# EasyEDA Pro project Kaleidoscope.eprj

# Schematic ESP32 Kaleidoscope V2
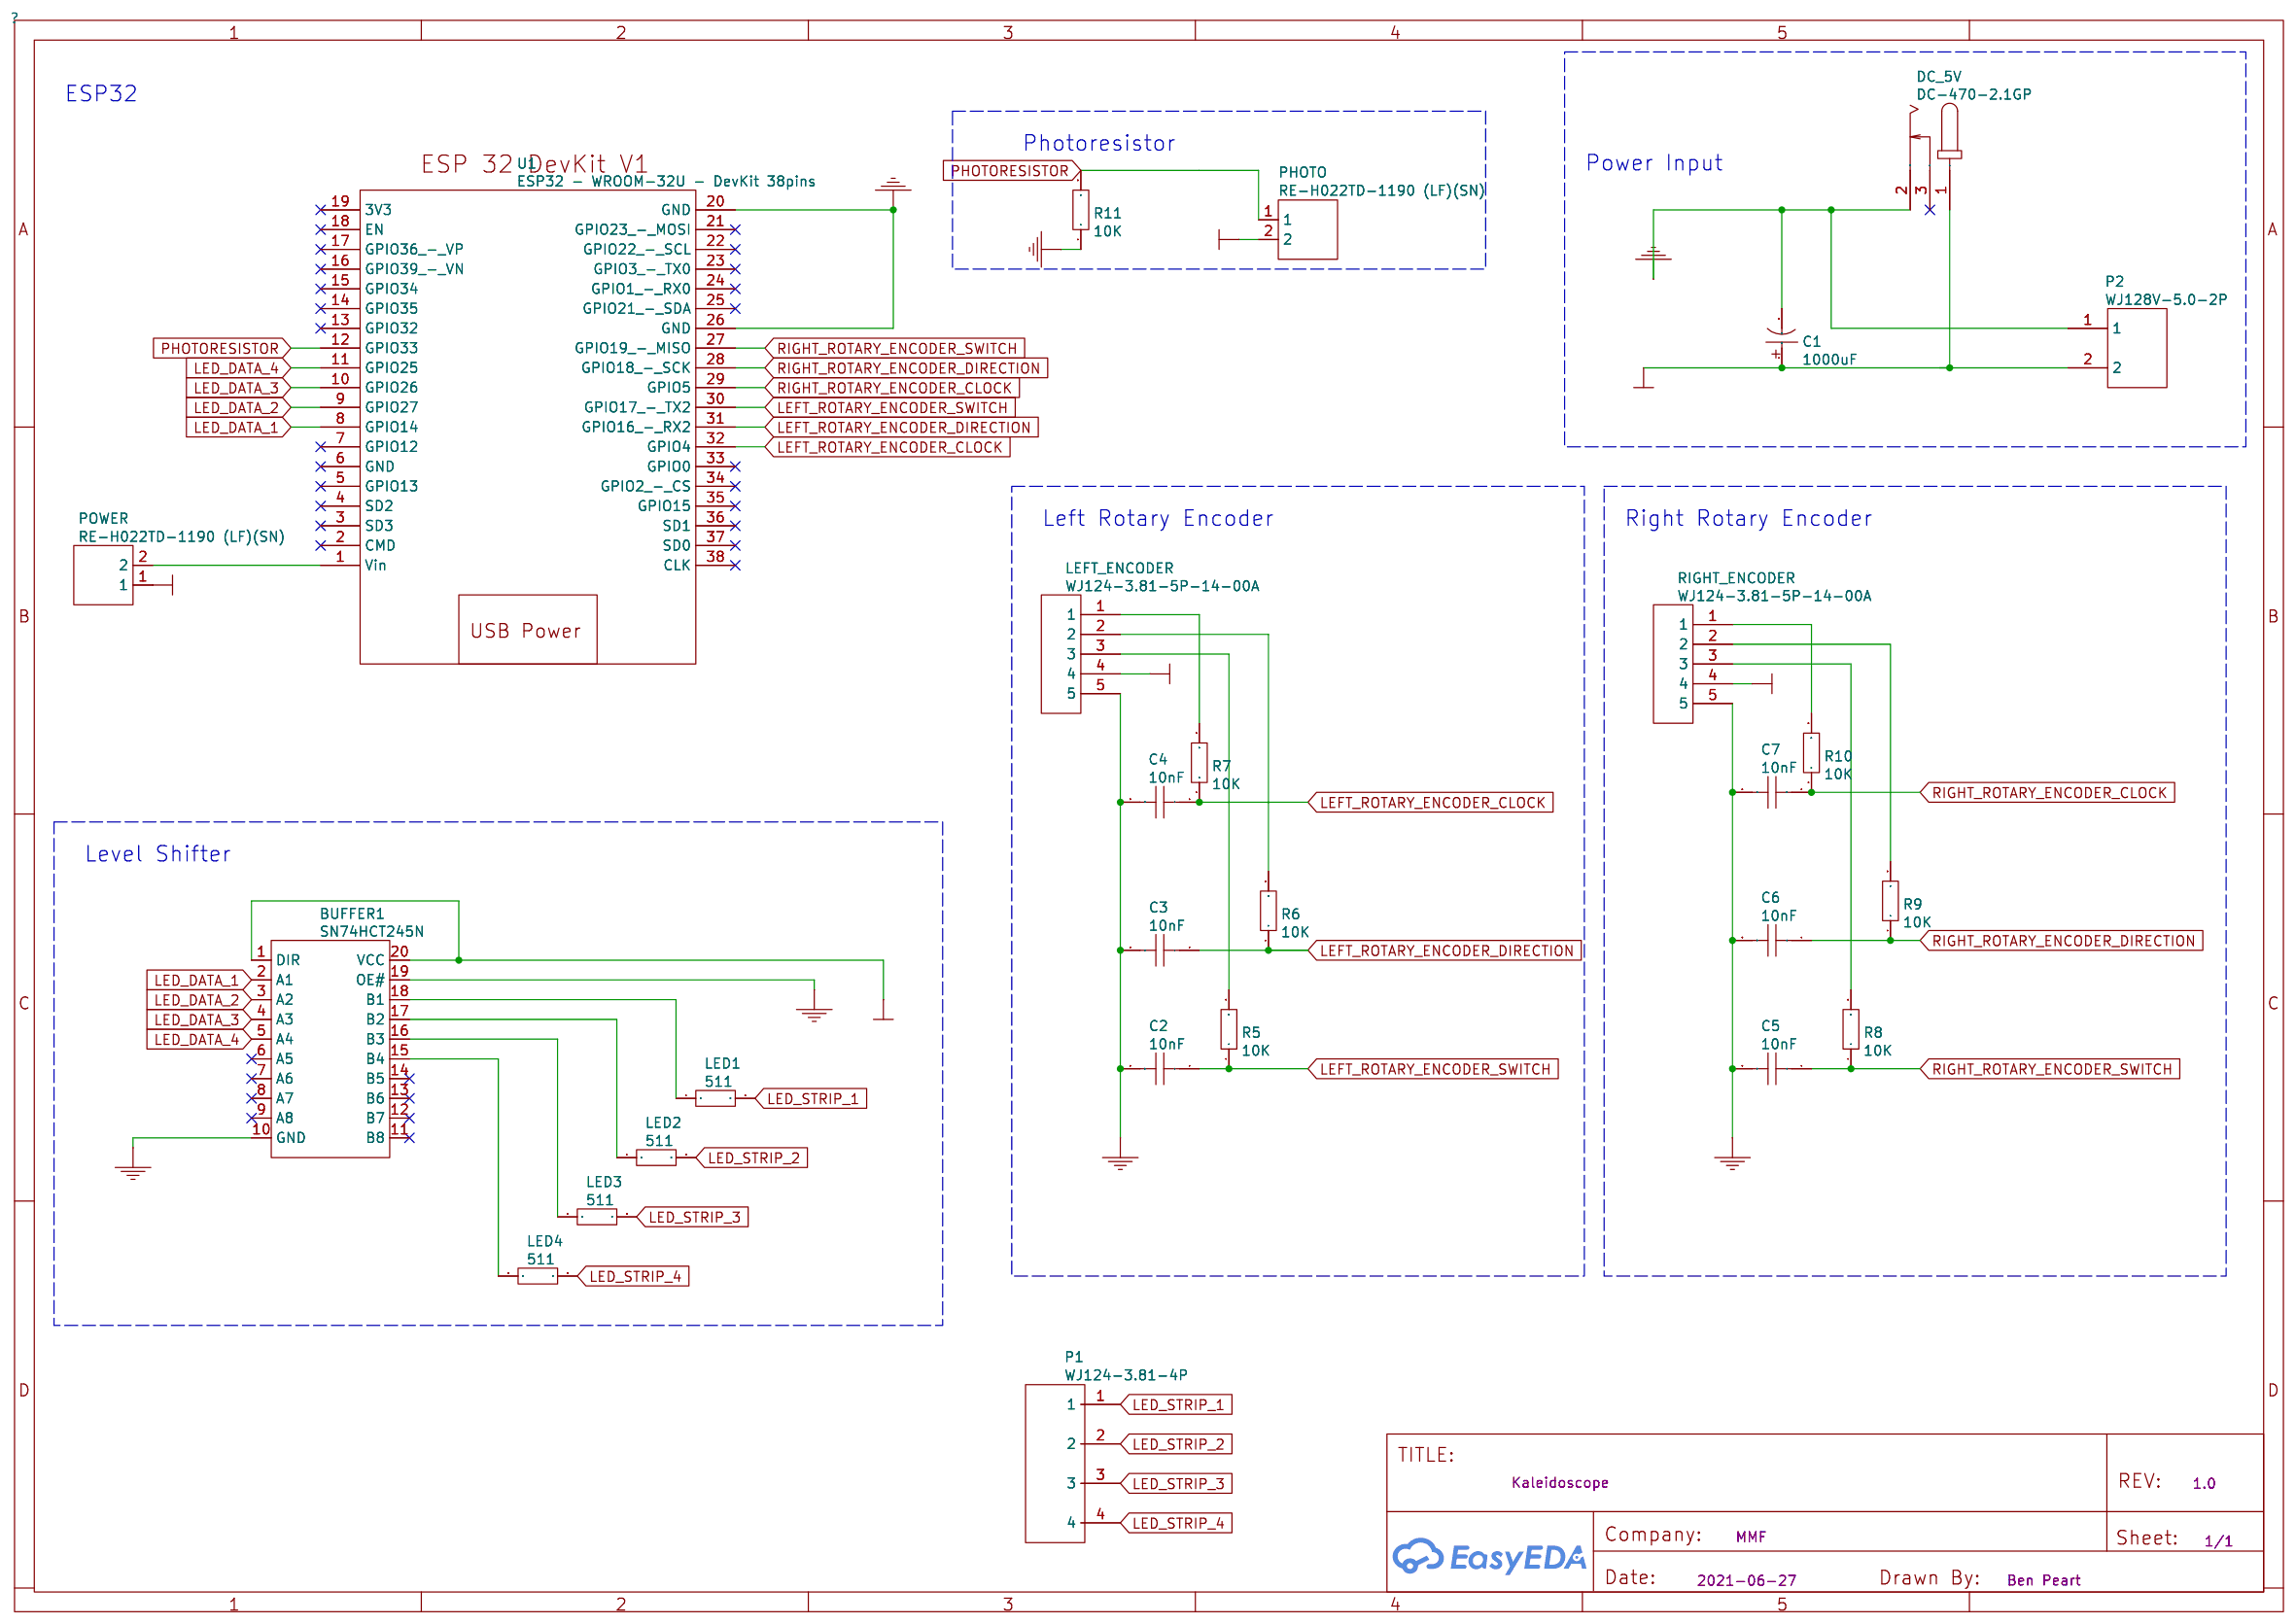
[diagram p0: schematic sheet]

## Parts
BUFFER1  SN74HCT245N  [DIP-20_L26.8-W6.4-P2.54-LS7.6-BL]
C1  1000uF  [CAP-TH_BD10.0-P5.00-D1.0-FD]
C2  10nF  [CAP-TH_L5.0-W2.5-P2.54-D0.7]
C3  10nF  [CAP-TH_L5.0-W2.5-P2.54-D0.7]
C4  10nF  [CAP-TH_L5.0-W2.5-P2.54-D0.7]
C5  10nF  [CAP-TH_L5.0-W2.5-P2.54-D0.7]
C6  10nF  [CAP-TH_L5.0-W2.5-P2.54-D0.7]
C7  10nF  [CAP-TH_L5.0-W2.5-P2.54-D0.7]
DC_5V  DC-470-2.1GP  [DC-IN-TH_DC-470-2.1GP]
LED1  511  [R0603]
LED2  511  [R0603]
LED3  511  [R0603]
LED4  511  [R0603]
LEFT_ENCODER  WJ124-3.81-5P-14-00A  [CONN-TH_5P-P3.81_KF124-3.81-5P]
P1  WJ124-3.81-4P  [CONN-TH_4P-P3.81_KF124-3.81-4P]
P2  WJ128V-5.0-2P  [CONN-TH_2P-P5.00_WJ128V-5.0-2P]
PHOTO  RE-H022TD-1190 (LF)(SN)  [HDR-TH_2P-P2.54-V]
POWER  RE-H022TD-1190 (LF)(SN)  [HDR-TH_2P-P2.54-V]
R5  10K  [R0603]
R6  10K  [R0603]
R7  10K  [R0603]
R8  10K  [R0603]
R9  10K  [R0603]
R10  10K  [R0603]
R11  10K  [R0603]
RIGHT_ENCODER  WJ124-3.81-5P-14-00A  [CONN-TH_5P-P3.81_KF124-3.81-5P]
U1  ESP32 - WROOM-32U - DevKit 38pins  [ESP32 - WROOM-32U - DEVVKIT 38PIN]

## Library data of the parts
BUFFER1 = SN74HCT245N: Supplier: LCSC; Supplier Part: C133640; Manufacturer: Texas Instruments
C1 = 1000uF: Supplier: LCSC; Manufacturer: Rubycon; Manufacturer Part: 25YXJ1000M10X20; Supplier Part: C88720; JLCPCB Part Class: Extended Part
C2-C7 = 10nF: Indicating Instrument; 2 Leads; Supplier: LCSC; Supplier Part: C254082; Manufacturer: Dersonic; Manufacturer Part: CC1H103ZA1AD3F4D10MF; JLCPCB Part Class: Extended Part
DC_5V = DC-470-2.1GP: Supplier: LCSC; Supplier Part: C194407; Manufacturer: GANGYUAN
LED1-LED4 = 511: Supplier: LCSC; Manufacturer: YAGEO; Manufacturer Part: RC0603FR-07511RL; Supplier Part: C137703; JLCPCB Part Class: Extended Part
LEFT_ENCODER RIGHT_ENCODER = WJ124-3.81-5P-14-00A: Supplier: LCSC; Manufacturer: ReliaPro; Supplier Part: C72336; Paste Type: expand
P1 = WJ124-3.81-4P: Supplier: LCSC; Manufacturer: ReliaPro; Supplier Part: C69809; JLCPCB Part Class: Extended Part
P2 = WJ128V-5.0-2P: Supplier: LCSC; Manufacturer: ReliaPro; Supplier Part: C8269; JLCPCB Part Class: Extended Part
PHOTO POWER = RE-H022TD-1190 (LF)(SN): Supplier: LCSC; Supplier Part: C160332; Manufacturer: JST Sales America; JLCPCB Part Class: Extend; Paste Type: expand
R5-R11 = 10K: Supplier: LCSC; Supplier Part: C217687; Manufacturer: Viking Tech; Manufacturer Part: ARG03FTC1002; JLCPCB Part Class: Extended Part
U1 = ESP32 - WROOM-32U - DevKit 38pins: Supplier: Sparkfun

## Nets
+5V: BUFFER1.1(DIR) BUFFER1.20(VCC) C1.1 DC_5V.1 LEFT_ENCODER.4 P2.2 PHOTO.2 POWER.1 RIGHT_ENCODER.4
GND: BUFFER1.10(GND) BUFFER1.19(OE#) C1.2 C2.2 C3.2 C4.2 C5.2 C6.2 C7.2 DC_5V.2 LEFT_ENCODER.5 P2.1 R11.1 RIGHT_ENCODER.5 U1.20(GND) U1.26(GND)
LED_DATA_1: BUFFER1.2(A1) U1.8(GPIO14)
LED_DATA_2: BUFFER1.3(A2) U1.9(GPIO27)
LED_DATA_3: BUFFER1.4(A3) U1.10(GPIO26)
LED_DATA_4: BUFFER1.5(A4) U1.11(GPIO25)
LED_STRIP_1: LED1.2 P1.1
LED_STRIP_2: LED2.2 P1.2
LED_STRIP_3: LED3.2 P1.3
LED_STRIP_4: LED4.2 P1.4
LEFT_ROTARY_ENCODER_CLOCK: C4.1 R7.1 U1.32(GPIO4)
LEFT_ROTARY_ENCODER_DIRECTION: C3.1 R6.1 U1.31(GPIO16 - RX2)
LEFT_ROTARY_ENCODER_SWITCH: C2.1 R5.1 U1.30(GPIO17 - TX2)
PHOTORESISTOR: PHOTO.1 R11.2 U1.12(GPIO33)
RIGHT_ROTARY_ENCODER_CLOCK: C7.1 R10.1 U1.29(GPIO5)
RIGHT_ROTARY_ENCODER_DIRECTION: C6.1 R9.1 U1.28(GPIO18 - SCK)
RIGHT_ROTARY_ENCODER_SWITCH: C5.1 R8.1 U1.27(GPIO19 - MISO)
BUFFER1_15: BUFFER1.15(B4) LED4.1
BUFFER1_16: BUFFER1.16(B3) LED3.1
BUFFER1_17: BUFFER1.17(B2) LED2.1
BUFFER1_18: BUFFER1.18(B1) LED1.1
LEFT_ENCODER_1: LEFT_ENCODER.1 R7.2
LEFT_ENCODER_2: LEFT_ENCODER.2 R6.2
LEFT_ENCODER_3: LEFT_ENCODER.3 R5.2
RIGHT_ENCODER_1: R10.2 RIGHT_ENCODER.1
RIGHT_ENCODER_2: R9.2 RIGHT_ENCODER.2
RIGHT_ENCODER_3: R8.2 RIGHT_ENCODER.3
U1_1: POWER.2 U1.1(Vin)

Not connected (* = marked no-connect by the designer): BUFFER1 6(A5)* 7(A6)* 8(A7)* 9(A8)* 11(B8)* 12(B7)* 13(B6)* 14(B5)*; DC_5V 3*; U1 2(CMD)* 3(SD3)* 4(SD2)* 5(GPIO13)* 6(GND)* 7(GPIO12)* 13(GPIO32)* 14(GPIO35)* 15(GPIO34)* 16(GPIO39 - VN)* 17(GPIO36 - VP)* 18(EN)* 19(3V3)* 21(GPIO23 - MOSI)* 22(GPIO22 - SCL)* 23(GPIO3 - TX0)* 24(GPIO1 - RX0)* 25(GPIO21 - SDA)* 33(GPIO0)* 34(GPIO2 - CS)* 35(GPIO15)* 36(SD1)* 37(SD0)* 38(CLK)*

## Notes on the sheet
- ESP32
- Photoresistor
- Power Input
- Left Rotary Encoder
- Right Rotary Encoder
- Level Shifter

# Board 1-PCB_PCB
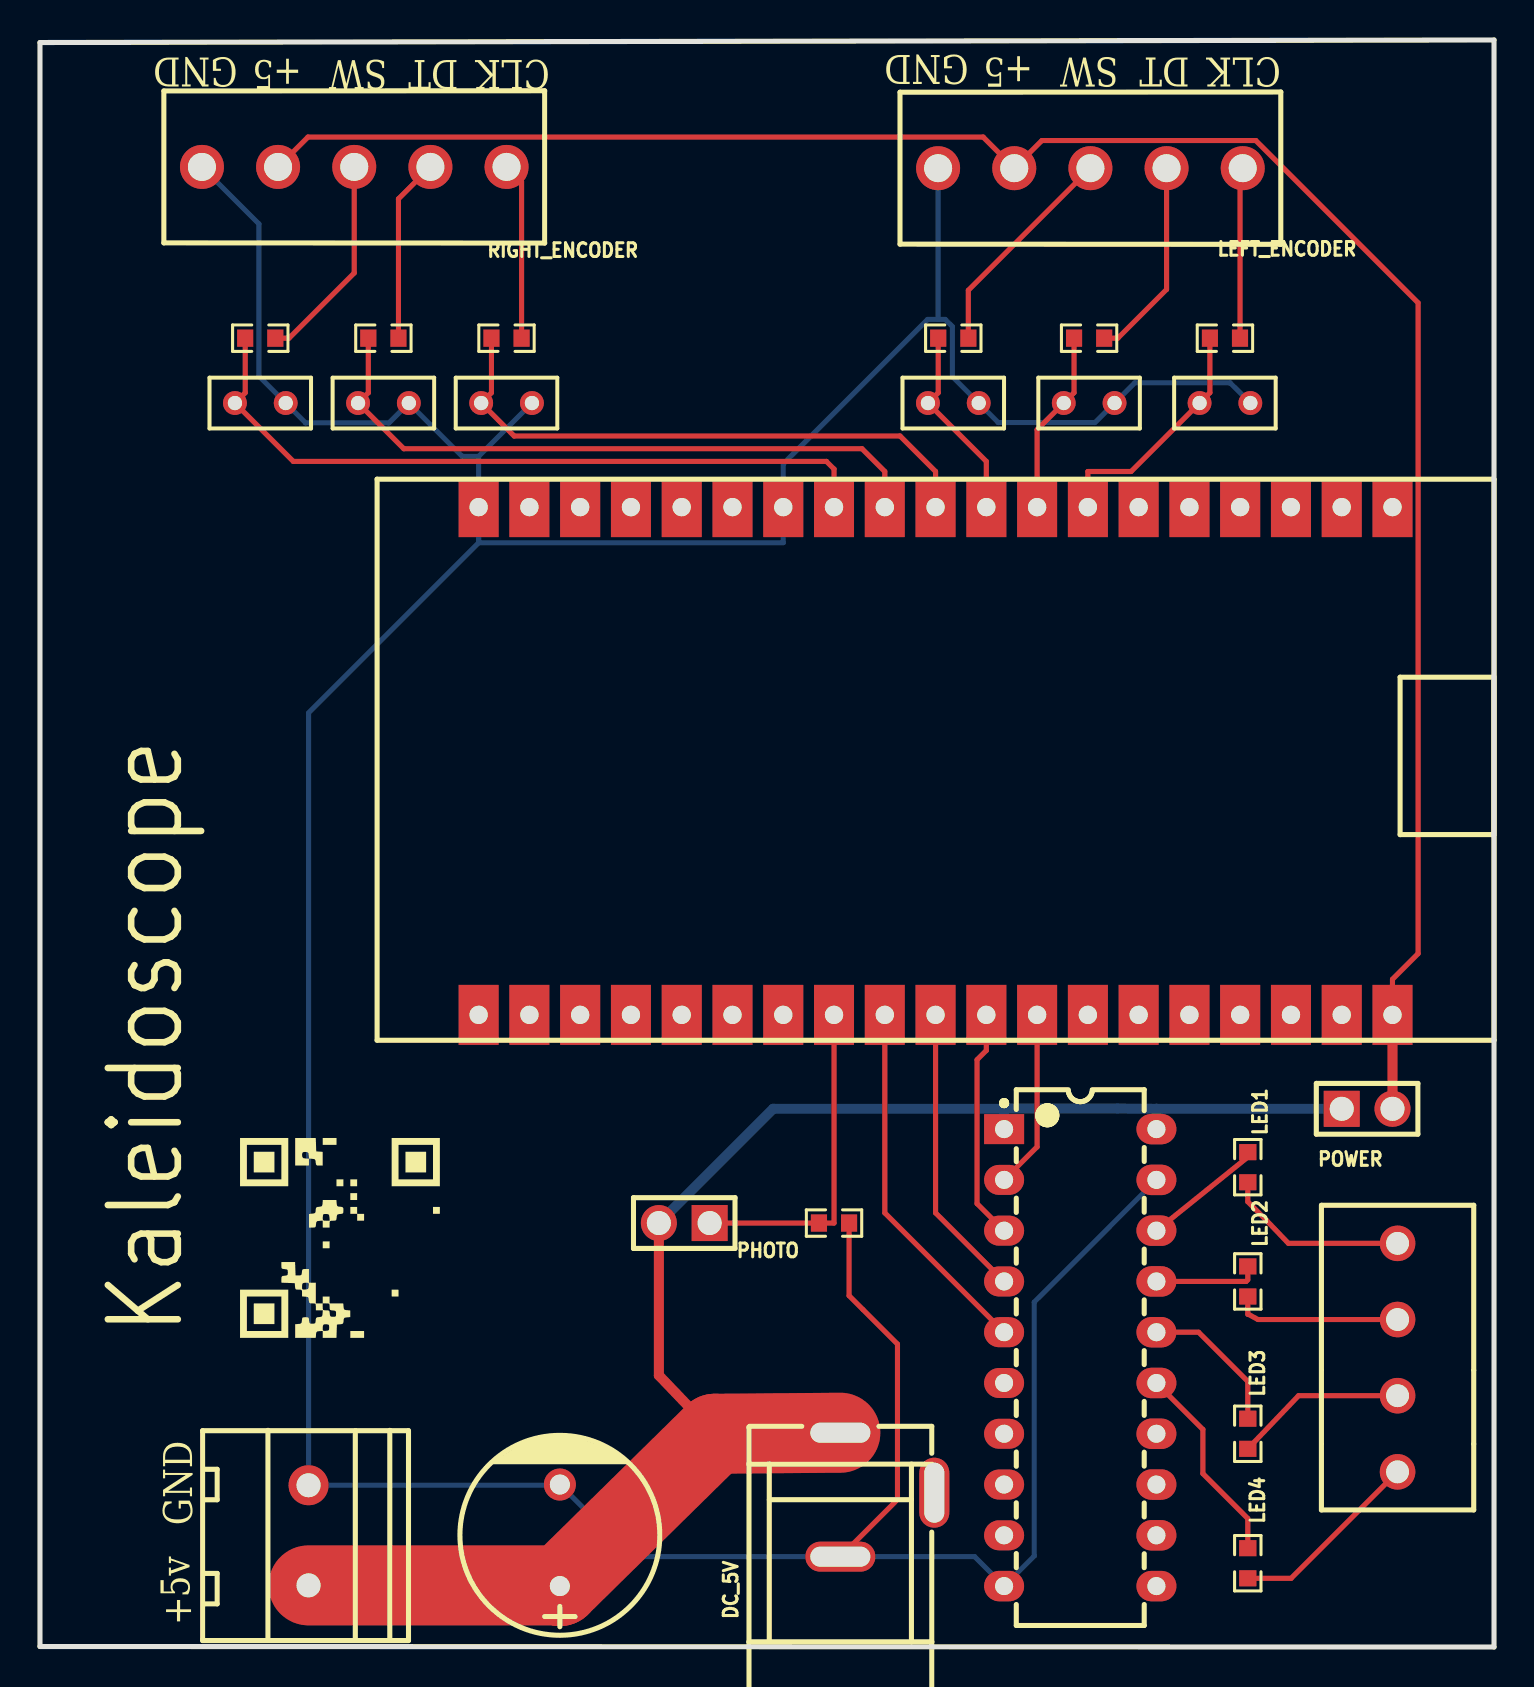
[diagram p1: board, top side]
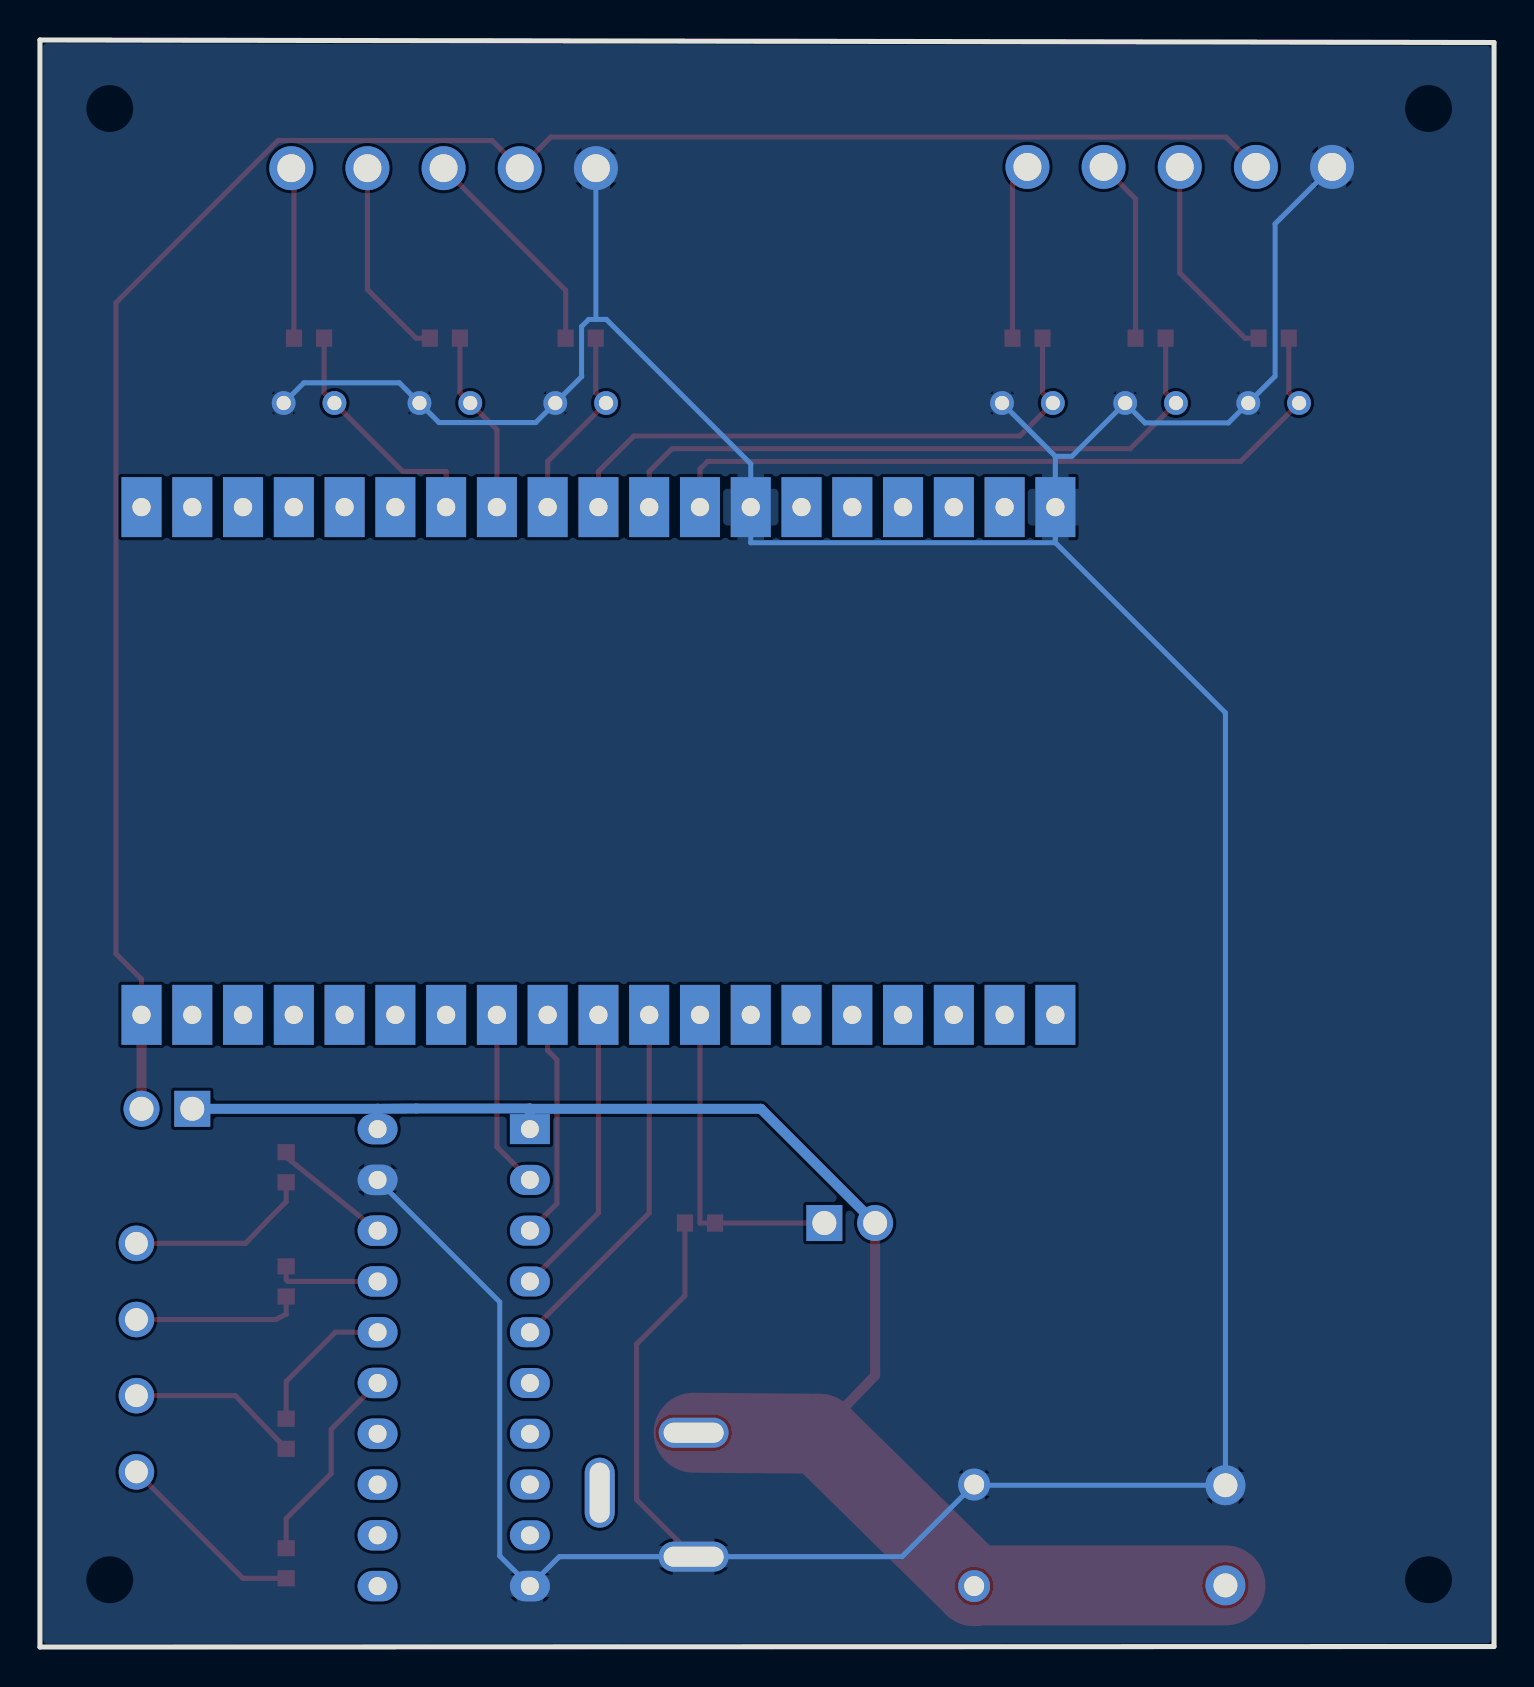
[diagram p2: board, bottom side, seen from below]

Outline 72.75 x 80.39 mm; copper layers: Top Layer, Bottom Layer. Coordinates in mm from the lower left corner of the outline.
Outline path: 0,80.26 72.75,80.39 72.75,0 0,0.03 0,80.26

## Design rules (mm)
spacing Default (default): track to track 0.152, other pairs 0 to 0.152
track width Default (default): min 0.254, default 0.254, max 25.4
via Default (default): diameter min 0.61, default 0.61, max 100.025; hole min 0.305, default 0.305, max 59.995
pour e49 uses gge5567

## Placement (name value [footprint] x y rotation side)
BUFFER1  SN74HCT245N  [DIP-20_L26.8-W6.4-P2.54-LS7.6-BL]  52.04 14.48 270 top
C1  1000uF  [CAP-TH_BD10.0-P5.00-D1.0-FD]  26.01 5.59 90 top
C2  10nF  [CAP-TH_L5.0-W2.5-P2.54-D0.7]  45.69 62.23 0 top
C3  10nF  [CAP-TH_L5.0-W2.5-P2.54-D0.7]  52.49 62.23 0 top
C4  10nF  [CAP-TH_L5.0-W2.5-P2.54-D0.7]  59.28 62.23 0 top
C5  10nF  [CAP-TH_L5.0-W2.5-P2.54-D0.7]  11.02 62.23 0 top
C6  10nF  [CAP-TH_L5.0-W2.5-P2.54-D0.7]  17.18 62.23 0 top
C7  10nF  [CAP-TH_L5.0-W2.5-P2.54-D0.7]  23.34 62.23 0 top
DC_5V  DC-470-2.1GP  [DC-IN-TH_DC-470-2.1GP]  42.39 7.62 90 top
LED1  511  [R0603]  60.43 24 270 top
LED2  511  [R0603]  60.43 18.29 270 top
LED3  511  [R0603]  60.43 10.67 270 top
LED4  511  [R0603]  60.43 4.19 270 top
LEFT_ENCODER  WJ124-3.81-5P-14-00A  [CONN-TH_5P-P3.81_KF124-3.81-5P]  52.55 73.98 180 top
P1  WJ124-3.81-4P  [CONN-TH_4P-P3.81_KF124-3.81-4P]  67.92 14.48 0 top
P2  WJ128V-5.0-2P  [CONN-TH_2P-P5.00_WJ128V-5.0-2P]  13.44 5.59 270 top
PHOTO  RE-H022TD-1190 (LF)(SN)  [HDR-TH_2P-P2.54-V]  32.23 21.21 180 top
POWER  RE-H022TD-1190 (LF)(SN)  [HDR-TH_2P-P2.54-V]  66.4 26.92 0 top
R5  10K  [R0603]  45.69 65.47 0 top
R6  10K  [R0603]  52.49 65.47 0 top
R7  10K  [R0603]  59.28 65.47 0 top
R8  10K  [R0603]  11.02 65.47 0 top
R9  10K  [R0603]  17.18 65.47 0 top
R10  10K  [R0603]  23.34 65.47 0 top
R11  10K  [R0603]  39.73 21.21 180 top
RIGHT_ENCODER  WJ124-3.81-5P-14-00A  [CONN-TH_5P-P3.81_KF124-3.81-5P]  15.72 74.04 180 top
U1  ESP32 - WROOM-32U - DevKit 38pins  [ESP32 - WROOM-32U - DEVVKIT 38PIN]  49.89 49.4 90 top

## Footprints (pads in the part's own frame, mm; a bottom-side part is the same pattern mirrored in y, then rotated)
CAP-TH_BD10.0-P5.00-D1.0-FD
  round 1.6 hole 1: 1(-2.54,0) 2(2.54,0)
CAP-TH_L5.0-W2.5-P2.54-D0.7
  round 1.194 hole 0.711: 1(-1.27,0) 2(1.27,0)
CONN-TH_2P-P5.00_WJ128V-5.0-2P
  round 2 hole 1.2: 1(-2.505,0) 2(2.505,0)
CONN-TH_4P-P3.81_KF124-3.81-4P
  round 1.778 hole 1.143: 1(0,5.715) 2(0,1.905) 3(0,-1.905) 4(0,-5.715)
CONN-TH_5P-P3.81_KF124-3.81-5P
  round 2.2 hole 1.4: 1(-7.62,0) 2(-3.81,0) 3(0,0) 4(3.81,0) 5(7.62,0)
DC-IN-TH_DC-470-2.1GP
  oval 1.5x3.5 hole 1x3: 1(3.1,2.35) 2(-3.1,2.35)
  oval 3.5x1.5 hole 3x1: 3(0.1,-2.35)
DIP-20_L26.8-W6.4-P2.54-LS7.6-BL
  rect 1.5x2 hole 0.9: 1(-11.43,-3.81)
  oval 1.5x2 hole 0.9: 2(-8.89,-3.81) 3(-6.35,-3.81) 4(-3.81,-3.81) 5(-1.27,-3.81) 6(1.27,-3.81) 7(3.81,-3.81) 8(6.35,-3.81) 9(8.89,-3.81)
  oval 1.524x2 hole 0.9: 10(11.43,-3.81) 11(11.43,3.81) 12(8.89,3.81) 13(6.35,3.81) 14(3.81,3.81) 15(1.27,3.81) 16(-1.27,3.81) 17(-3.81,3.81) 18(-6.35,3.81) 19(-8.89,3.81) 20(-11.43,3.81)
ESP32 - WROOM-32U - DEVVKIT 38PIN
  rect 3x2 hole 0.914: 1(-17.78,-17.78) 2(-17.78,-15.24) 3(-17.78,-12.7) 4(-17.78,-10.16) 5(-17.78,-7.62) 6(-17.78,-5.08) 7(-17.78,-2.54) 8(-17.78,0) 9(-17.78,2.54) 10(-17.78,5.08) 11(-17.78,7.62) 12(-17.78,10.16) 13(-17.78,12.7) 14(-17.78,15.24) 15(-17.78,17.78) 16(-17.78,20.32) 17(-17.78,22.86) 18(-17.78,25.4) 19(-17.78,27.94) 20(7.62,27.94) 21(7.62,25.4) 22(7.62,22.86) 23(7.62,20.32) 24(7.62,17.78) 25(7.62,15.24) 26(7.62,12.7) 27(7.62,10.16) 28(7.62,7.62) 29(7.62,5.08) 30(7.62,2.54) 31(7.62,0) 32(7.62,-2.54) 33(7.62,-5.08) 34(7.62,-7.62) 35(7.62,-10.16) 36(7.62,-12.7) 37(7.62,-15.24) 38(7.62,-17.78)
HDR-TH_2P-P2.54-V
  rect 1.8x1.8 hole 1.2: 1(-1.27,0)
  round 1.8 hole 1.2: 2(1.27,0)
R0603
  rect 0.806x0.864 smd: 1(-0.753,0) 2(0.753,0)

## Nets
+5V: BUFFER1.1 BUFFER1.20 C1.1 DC_5V.1 LEFT_ENCODER.4 P2.2 PHOTO.2 POWER.1 RIGHT_ENCODER.4
GND: BUFFER1.10 BUFFER1.19 C1.2 C2.2 C3.2 C4.2 C5.2 C6.2 C7.2 DC_5V.2 LEFT_ENCODER.5 P2.1 R11.1 RIGHT_ENCODER.5 U1.20 U1.26
BUFFER1_15: BUFFER1.15 LED4.1
BUFFER1_16: BUFFER1.16 LED3.1
BUFFER1_17: BUFFER1.17 LED2.1
BUFFER1_18: BUFFER1.18 LED1.1
LEDDATA1: BUFFER1.2 U1.8
LEDDATA2: BUFFER1.3 U1.9
LEDDATA3: BUFFER1.4 U1.10
LEDDATA4: BUFFER1.5 U1.11
LEDSTRIP1: LED1.2 P1.1
LEDSTRIP2: LED2.2 P1.2
LEDSTRIP3: LED3.2 P1.3
LEDSTRIP4: LED4.2 P1.4
LEFT_ENCODER_1: LEFT_ENCODER.1 R7.2
LEFT_ENCODER_2: LEFT_ENCODER.2 R6.2
LEFT_ENCODER_3: LEFT_ENCODER.3 R5.2
LEFTROTARYENCODERCLOCK: C4.1 R7.1 U1.32
LEFTROTARYENCODERDIRECTION: C3.1 R6.1 U1.31
LEFTROTARYENCODERSWITCH: C2.1 R5.1 U1.30
PHOTORESISTOR: PHOTO.1 R11.2 U1.12
RIGHT_ENCODER_1: R10.2 RIGHT_ENCODER.1
RIGHT_ENCODER_2: R9.2 RIGHT_ENCODER.2
RIGHT_ENCODER_3: R8.2 RIGHT_ENCODER.3
RIGHTROTARYENCODERCLOCK: C7.1 R10.1 U1.29
RIGHTROTARYENCODERDIRECTION: C6.1 R9.1 U1.28
RIGHTROTARYENCODERSWITCH: C5.1 R8.1 U1.27
U1_1: POWER.2 U1.1

Pads without a net: BUFFER1 6 7 8 9 11 12 13 14; DC_5V 3; U1 2 3 4 5 6 7 13 14 15 16 17 18 19 21 22 23 24 25 33 34 35 36 37 38

## Routing (per net, layer and track width the routed paths; a pad name or vN(x,y) marks a point on that pad's centre or on a via; arc(x,y) is an arc through that point)
+5V: length 184.9
  Top Layer w0.254: RIGHT_ENCODER.4 13.41,75.54 47.18,75.54 LEFT_ENCODER.4 50.13,75.36 60.83,75.36 68.95,67.24 68.95,34.69 67.67,33.4 67.67,31.62
  Top Layer w0.5: 33.76,10.67 30.96,13.59 PHOTO.2 ; 67.67,31.62 67.67,26.92
  Top Layer w4: DC_5V.1 33.76,10.67 26.01,3.05 25.97,3.08 P2.2
  Bottom Layer w0.254: PHOTO.2 31.74,21.21
  Bottom Layer w0.5: PHOTO.2 36.68,26.92 48.23,26.92 BUFFER1.1 48.23,26.94 53.89,26.94 55.85,26.92 ; POWER.1 55.85,26.92 ; 55.85,26.92 BUFFER1.20
GND: length 222.9
  Top Layer w0.254: R11.1 40.48,17.58 41.16,16.89 42.9,15.15 42.9,7.38 40.04,4.52
  Bottom Layer w0.254: 44.93,66.41 44.41,66.41 37.19,59.19 U1.26 37.19,55.24 21.95,55.24 ; 44.93,66.41 44.93,73.98 ; 44.93,66.41 45.29,66.41 45.65,66.06 45.65,63.55 C2.2 47.94,61.25 52.78,61.25 C3.2 54.77,63.24 59.54,63.24 C4.2 ; 21.95,59.56 C7.2 ; 21.95,59.56 U1.20 ; 21.95,59.56 21.12,59.56 C6.2 17.46,61.24 13.29,61.24 C5.2 10.95,63.57 10.95,71.19 RIGHT_ENCODER.5 ; U1.20 21.95,55.24 ; U1.20 21.95,55.24 ; 21.95,55.24 13.44,46.73 P2.1 25.97,8.09 C1.2 29.62,4.52 DC_5V.2 46.76,4.52 BUFFER1.10 49.74,4.56 49.74,17.26 BUFFER1.19
BUFFER1_15: length 10.2
  Top Layer w0.254: BUFFER1.15 58.18,10.88 58.18,8.68 60.43,6.43 LED4.1
BUFFER1_16: length 7.5
  Top Layer w0.254: LED3.1 60.43,13.29 57.96,15.75 BUFFER1.16
BUFFER1_17: length 5.3
  Top Layer w0.254: BUFFER1.17 60.34,18.29 60.43,18.37 LED2.1
BUFFER1_18: length 5.9
  Top Layer w0.254: BUFFER1.18 60.43,24.51
LEDDATA1: length 8.9
  Top Layer w0.254: U1.8 49.89,25.02 BUFFER1.2
LEDDATA2: length 11.5
  Top Layer w0.254: BUFFER1.3 46.88,22.18 46.88,29.38 47.35,29.84 U1.9
LEDDATA3: length 14.8
  Top Layer w0.254: BUFFER1.4 44.81,21.72 U1.10
LEDDATA4: length 18.3
  Top Layer w0.254: U1.11 42.27,21.72 BUFFER1.5
LEDSTRIP1: length 9.1
  Top Layer w0.254: 60.43,23 60.43,22.27 61.37,21.33 62.46,20.19 P1.1
LEDSTRIP2: length 8.3
  Top Layer w0.254: 60.43,16.64 LED2.2 ; 60.43,16.66 60.93,16.38 67.79,16.38
LEDSTRIP3: length 8.6
  Top Layer w0.254: P1.3 62.97,12.57 LED3.2
LEDSTRIP4: length 9.7
  Top Layer w0.254: LED4.2 62.59,3.44 P1.4
LEFT_ENCODER_1: length 8.6
  Top Layer w0.254: LEFT_ENCODER.1 60.04,73.84 R7.2
LEFT_ENCODER_2: length 10.2
  Top Layer w0.254: LEFT_ENCODER.2 56.36,67.91 53.92,65.47 R6.2
LEFT_ENCODER_3: length 11
  Top Layer w0.254: LEFT_ENCODER.3 46.45,67.87 R5.2
LEFTROTARYENCODERCLOCK: length 12.2
  Top Layer w0.254: R7.1 58.53,62.75 C4.1 54.59,58.8 52.43,58.8 U1.32
LEFTROTARYENCODERDIRECTION: length 9.2
  Top Layer w0.254: U1.31 49.89,60.9 C3.1 51.73,62.74 R6.1
LEFTROTARYENCODERSWITCH: length 9.9
  Top Layer w0.254: R5.1 44.94,62.74 C2.1 47.35,59.31 U1.30
PHOTORESISTOR: length 16.6
  Top Layer w0.254: PHOTO.1 R11.2 39.73,21.21 U1.12
RIGHT_ENCODER_1: length 8.9
  Top Layer w0.254: R10.2 24.09,73.29 RIGHT_ENCODER.1
RIGHT_ENCODER_2: length 9.2
  Top Layer w0.254: RIGHT_ENCODER.2 17.93,72.44 R9.2
RIGHT_ENCODER_3: length 10.6
  Top Layer w0.254: R8.2 12.46,65.47 15.72,68.74 RIGHT_ENCODER.3
RIGHTROTARYENCODERCLOCK: length 29.4
  Top Layer w0.254: R10.1 22.59,62.74 C7.1 23.72,60.58 43.03,60.58 44.81,58.8 ; U1.29 44.81,58.8
RIGHTROTARYENCODERDIRECTION: length 33
  Top Layer w0.254: 42.27,58.8 41.13,59.94 18.2,59.94 C6.1 16.43,62.74 R9.1 ; U1.28 42.27,58.8
RIGHTROTARYENCODERSWITCH: length 36.7
  Top Layer w0.254: R8.1 10.27,62.74 C5.1 12.67,59.31 39.34,59.31 39.73,58.93 U1.27

## Copper pours and planes (outline as drawn; the poured copper is in the pictures)
GND on Bottom Layer: 72.75,0 -0.03,0 0.1,80.14 -0.03,80.26 72.75,80.39

## Text on the board
Top Silkscreen Layer: Kaleidoscope | +5v | GND | +5 | SW | DT | CLK
